# Altium schematic sheet LIDO-HW.100.InputStage.SchDoc
size A3; SheetNumber: 8; SheetTotal: 16
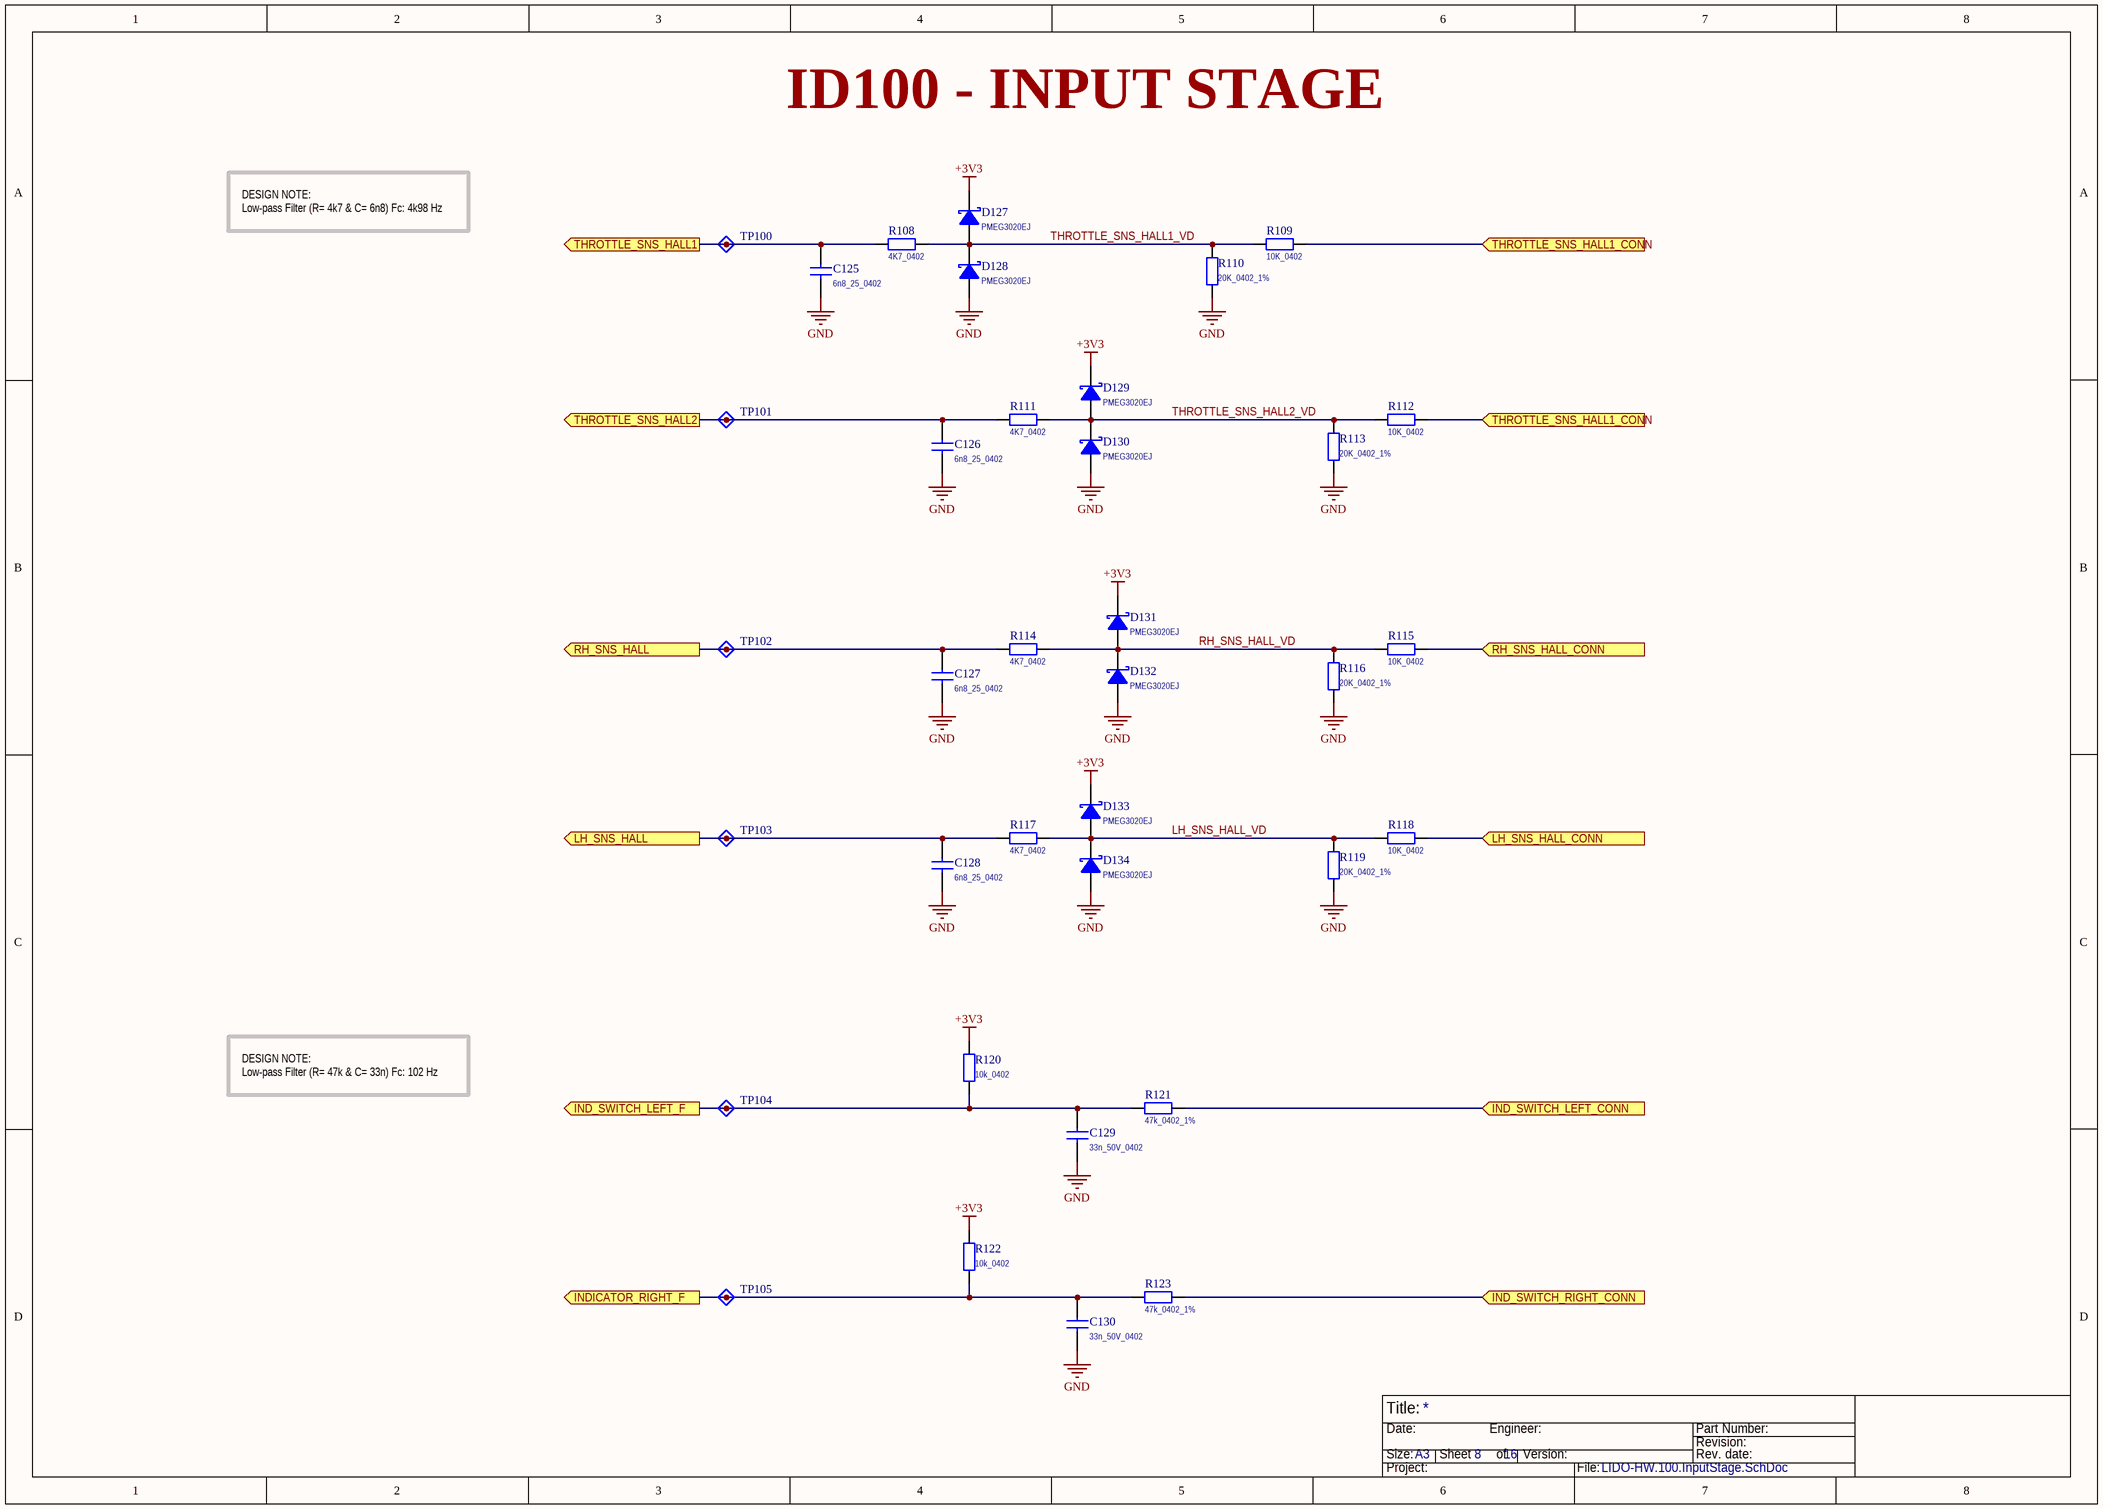
[diagram p0: LIDO-HW.100.InputStage.SchDoc]

## Parts
C125  6n8_25_0402
C126  6n8_25_0402
C127  6n8_25_0402
C128  6n8_25_0402
C129  33n_50V_0402
C130  33n_50V_0402
D127  PMEG3020EJ
D128  PMEG3020EJ
D129  PMEG3020EJ
D130  PMEG3020EJ
D131  PMEG3020EJ
D132  PMEG3020EJ
D133  PMEG3020EJ
D134  PMEG3020EJ
R108  4K7_0402
R109  10K_0402
R110  20K_0402_1%
R111  4K7_0402
R112  10K_0402
R113  20K_0402_1%
R114  4K7_0402
R115  10K_0402
R116  20K_0402_1%
R117  4K7_0402
R118  10K_0402
R119  20K_0402_1%
R120  10k_0402
R121  47k_0402_1%
R122  10k_0402
R123  47k_0402_1%
TP100  TestPoint_A  (value not drawn)  (no BOM)
TP101  TestPoint_A  (value not drawn)  (no BOM)
TP102  TestPoint_A  (value not drawn)  (no BOM)
TP103  TestPoint_A  (value not drawn)  (no BOM)
TP104  TestPoint_A  (value not drawn)  (no BOM)
TP105  TestPoint_A  (value not drawn)  (no BOM)

## Ports
IND_SWITCH_LEFT_CONN (in), IND_SWITCH_LEFT_F (out), IND_SWITCH_RIGHT_CONN (in), INDICATOR_RIGHT_F (out), LH_SNS_HALL (out), LH_SNS_HALL_CONN (in), RH_SNS_HALL (out), RH_SNS_HALL_CONN (in), THROTTLE_SNS_HALL1 (out), THROTTLE_SNS_HALL1_CONN (in), THROTTLE_SNS_HALL2 (out)

## Nets
+3V3: D127.C D129.C D131.C D133.C R120.2 R122.2
GND: C125.2 C126.2 C127.2 C128.2 C129.2 C130.2 D128.A D130.A D132.A D134.A R110.1 R113.1 R116.1 R119.1
IND_SWITCH_LEFT_CONN: R121.2 ; port IND_SWITCH_LEFT_CONN
IND_SWITCH_LEFT_F: C129.1 R120.1 R121.1 TP104.1(TP) ; port IND_SWITCH_LEFT_F
IND_SWITCH_RIGHT_CONN: R123.2 ; port IND_SWITCH_RIGHT_CONN
INDICATOR_RIGHT_F: C130.1 R122.1 R123.1 TP105.1(TP) ; port INDICATOR_RIGHT_F
LH_SNS_HALL: C128.1 R117.1 TP103.1(TP) ; port LH_SNS_HALL
LH_SNS_HALL_CONN: R118.2 ; port LH_SNS_HALL_CONN
LH_SNS_HALL_VD: D133.A D134.C R117.2 R118.1 R119.2
RH_SNS_HALL: C127.1 R114.1 TP102.1(TP) ; port RH_SNS_HALL
RH_SNS_HALL_CONN: R115.2 ; port RH_SNS_HALL_CONN
RH_SNS_HALL_VD: D131.A D132.C R114.2 R115.1 R116.2
THROTTLE_SNS_HALL1: C125.1 R108.1 TP100.1(TP) ; port THROTTLE_SNS_HALL1
THROTTLE_SNS_HALL1_CONN: R109.2 R112.2 ; port THROTTLE_SNS_HALL1_CONN
THROTTLE_SNS_HALL1_VD: D127.A D128.C R108.2 R109.1 R110.2
THROTTLE_SNS_HALL2: C126.1 R111.1 TP101.1(TP) ; port THROTTLE_SNS_HALL2
THROTTLE_SNS_HALL2_VD: D129.A D130.C R111.2 R112.1 R113.2

## Notes on the sheet
- ID100 - INPUT STAGE
- DESIGN NOTE:
  Low-pass Filter (R= 4k7 & C= 6n8) Fc: 4k98 Hz
- DESIGN NOTE:
  Low-pass Filter (R= 47k & C= 33n) Fc: 102 Hz
- Title:
- Size:
- Date:
- A3
- Sheet       of
- Engineer:
- Version:
- Part Number:
- Revision:
- Rev. date:
- Project:
- File:

## Library data of the parts
C125-C130 = Ceramic: Ceramic CAP Symbol
D127-D134 = Schottky_A: Schottky Diode Symbol
R108-R123 = Resistor: Resistor Symbol
TP100-TP105 = TestPoint_A: Test Point Symbol verion A; 00_Name: TP_XXmm; 01_Diameter: 1mm; 02_Layer: *